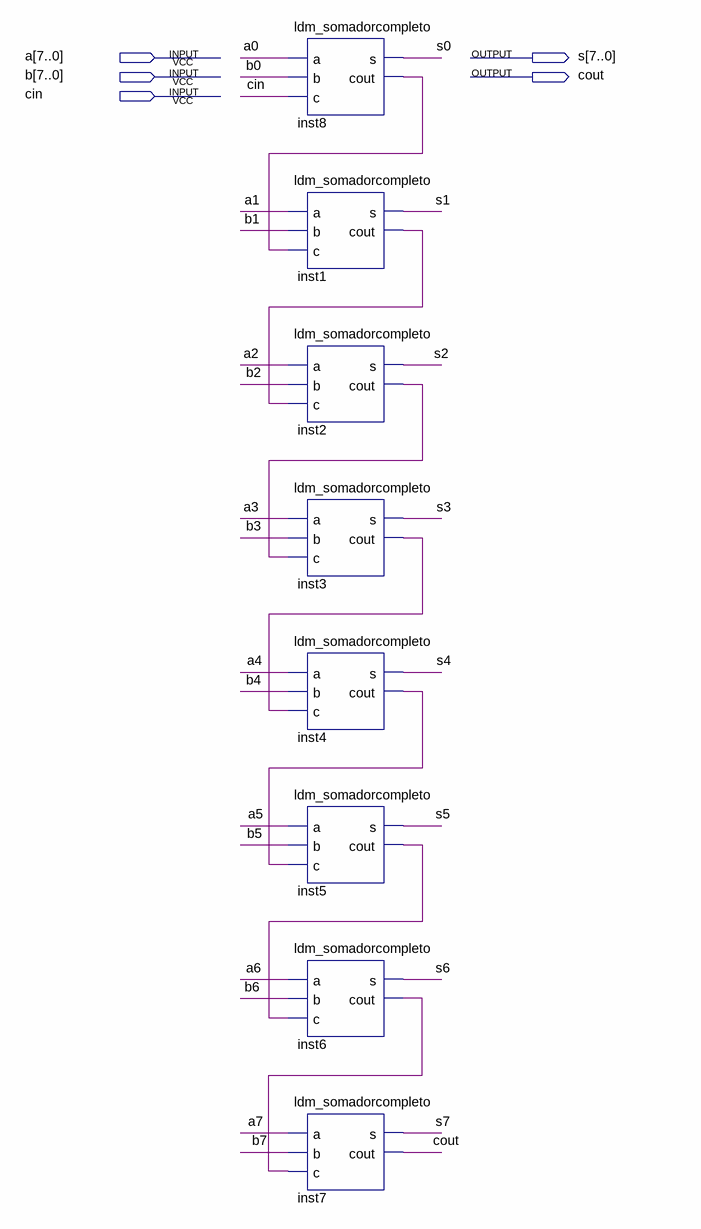
[diagram p0: schematic sheet]
// Quartus schematic ldm_rpa.bdf as structural Verilog: 8 symbols, 5 pins
module ldm_rpa (
  input  [7:0] a,
  input  [7:0] b,
  input  cin,
  output [7:0] s,
  output cout
);

  wire inst1_cout, inst2_cout, inst3_cout, inst4_cout, inst5_cout, inst6_cout, inst8_cout;

  ldm_somadorcompleto inst8 (.a(a[0]), .b(b[0]), .c(cin), .s(s[0]), .cout(inst8_cout));
  ldm_somadorcompleto inst1 (.a(a[1]), .b(b[1]), .c(inst8_cout), .s(s[1]), .cout(inst1_cout));
  ldm_somadorcompleto inst2 (.a(a[2]), .b(b[2]), .c(inst1_cout), .s(s[2]), .cout(inst2_cout));
  ldm_somadorcompleto inst3 (.a(a[3]), .b(b[3]), .c(inst2_cout), .s(s[3]), .cout(inst3_cout));
  ldm_somadorcompleto inst4 (.a(a[4]), .b(b[4]), .c(inst3_cout), .s(s[4]), .cout(inst4_cout));
  ldm_somadorcompleto inst5 (.a(a[5]), .b(b[5]), .c(inst4_cout), .s(s[5]), .cout(inst5_cout));
  ldm_somadorcompleto inst6 (.a(a[6]), .b(b[6]), .c(inst5_cout), .s(s[6]), .cout(inst6_cout));
  ldm_somadorcompleto inst7 (.a(a[7]), .b(b[7]), .c(inst6_cout), .s(s[7]), .cout(cout));
endmodule
